# Altium schematic sheet ActiTouch_Receiver_Sheet1.SchDoc
size A4; SheetNumber: 4; SheetTotal: 5
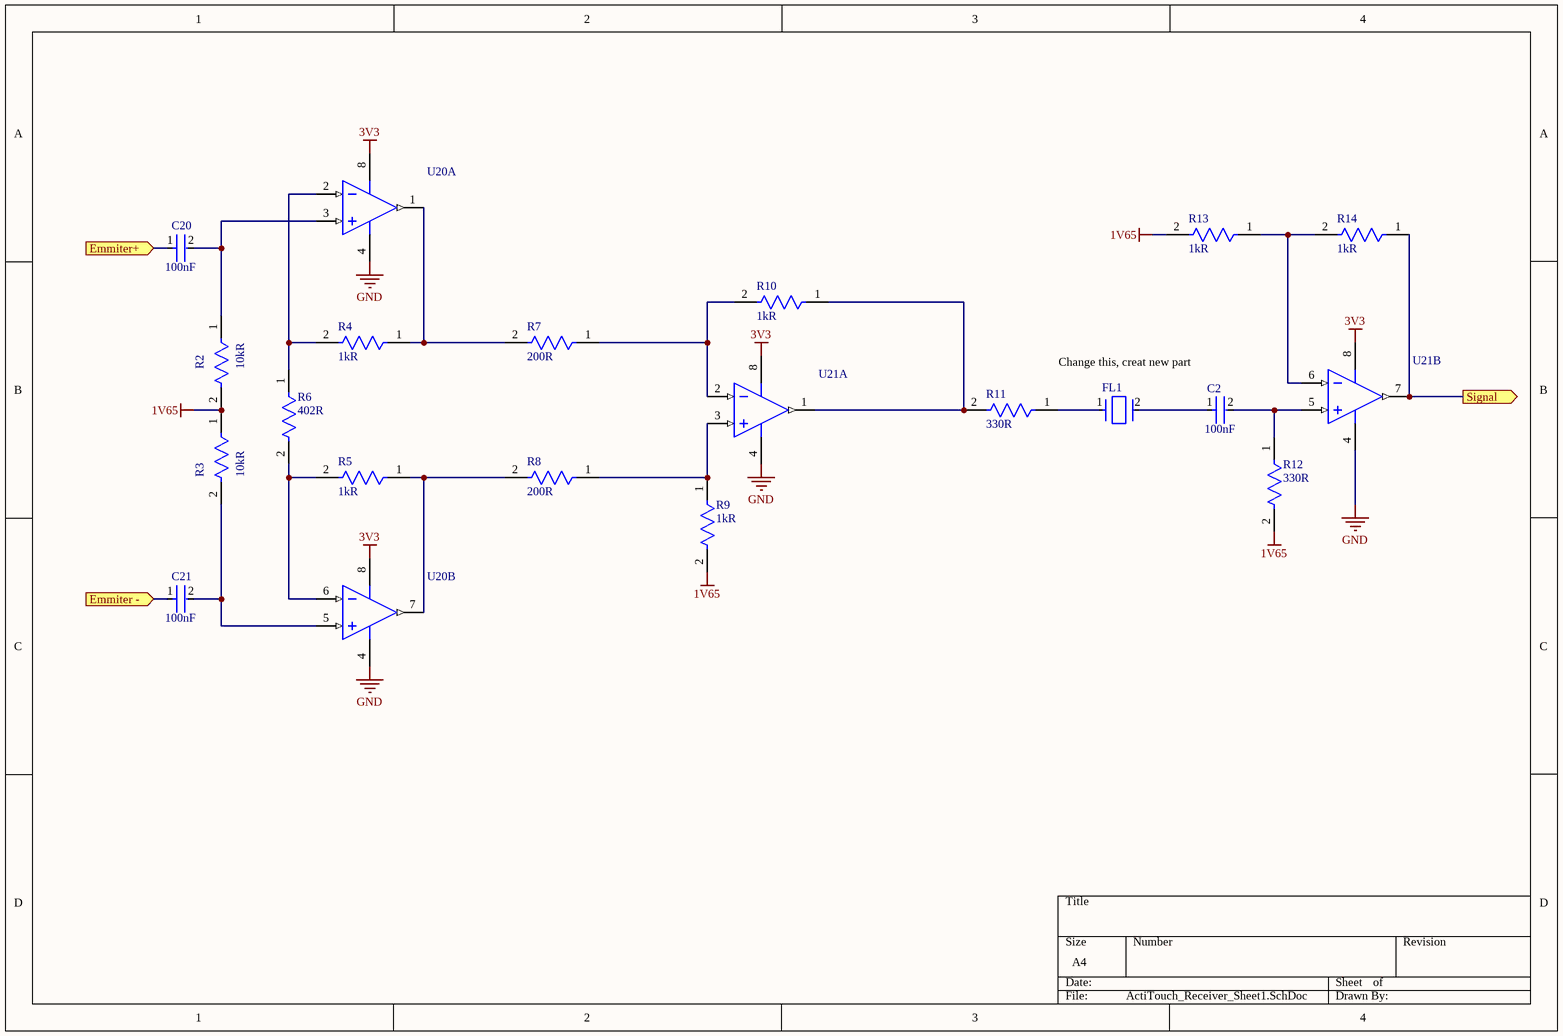
[diagram p0: ActiTouch_Receiver_Sheet1.SchDoc]

## Parts
C2  Capacitance: 100nF  [FP-0603-L_1_6_0_1-W_0_8_0-IPC_B]  (hidden comment: EMK107B7104KAHT)
C20  Capacitance: 100nF  [FP-0603-L_1_6_0_1-W_0_8_0-IPC_B]  (hidden comment: EMK107B7104KAHT)
C21  Capacitance: 100nF  [FP-0603-L_1_6_0_1-W_0_8_0-IPC_B]  (hidden comment: EMK107B7104KAHT)
FL1  CDSCB10M7GA121-R0  [FP-CDSCB10M7GA121-R0-MFG]  (value not drawn)
R2  Resistance: 10kR  [FP-ESR03-MFG]  (hidden comment: ESR03EZPJ101)
R3  Resistance: 10kR  [FP-ESR03-MFG]  (hidden comment: ESR03EZPJ101)
R4  Resistance: 1kR  [FP-ESR03-MFG]  (hidden comment: ESR03EZPJ101)
R5  Resistance: 1kR  [FP-ESR03-MFG]  (hidden comment: ESR03EZPJ101)
R6  Resistance: 402R  [FP-ESR03-MFG]  (hidden comment: ESR03EZPJ101)
R7  Resistance: 200R  [FP-ESR03-MFG]  (hidden comment: ESR03EZPJ101)
R8  Resistance: 200R  [FP-ESR03-MFG]  (hidden comment: ESR03EZPJ101)
R9  Resistance: 1kR  [FP-ESR03-MFG]  (hidden comment: ESR03EZPJ101)
R10  Resistance: 1kR  [FP-ESR03-MFG]  (hidden comment: ESR03EZPJ101)
R11  Resistance: 330R  [FP-ESR03-MFG]  (hidden comment: ESR03EZPJ101)
R12  Resistance: 330R  [FP-ESR03-MFG]  (hidden comment: ESR03EZPJ101)
R13  Resistance: 1kR  [FP-ESR03-MFG]  (hidden comment: ESR03EZPJ101)
R14  Resistance: 1kR  [FP-ESR03-MFG]  (hidden comment: ESR03EZPJ101)
U20  LTC6253IMS8#TRPBF  [LT-MS8-8_N]  (value not drawn)  (parts A,B of 2)
U21  LTC6253IMS8#TRPBF  [LT-MS8-8_N]  (value not drawn)  (parts A,B of 2)

## Ports
Emmiter - (in), Emmiter+ (in), Signal (out)

## Nets
1V65: R2.2 R3.1 R9.2 R12.2 R13.2
3V3: U20.8(V+) U21.8(V+)
GND: U20.4(V-) U21.4(V-)
Emmiter -: C21.1 ; port Emmiter -
Emmiter+: C20.1 ; port Emmiter+
Signal: R14.1 U21.7(OUT_B) ; port Signal
NetC2_1: C2.1 FL1.2
NetC2_2: C2.2 R12.1 U21.5(+IN_B)
NetC20_2: C20.2 R2.1 U20.3(+IN_A)
NetC21_2: C21.2 R3.2 U20.5(+IN_B)
NetFL1_1: FL1.1 R11.1
NetR4_1: R4.1 R7.2 U20.1(OUT_A)
NetR4_2: R4.2 R6.1 U20.2(-IN_A)
NetR5_1: R5.1 R8.2 U20.7(OUT_B)
NetR5_2: R5.2 R6.2 U20.6(-IN_B)
NetR7_1: R7.1 R10.2 U21.2(-IN_A)
NetR8_1: R8.1 R9.1 U21.3(+IN_A)
NetR10_1: R10.1 R11.2 U21.1(OUT_A)
NetR13_1: R13.1 R14.2 U21.6(-IN_B)

## Notes on the sheet
- Change this, creat new part

## Library data of the parts
C2 C20 C21 = CMP-14477-003798-2: None; Voltage Rating (DC): 16V; Tolerance: 10%; Package Quantity: 4000; Packaging: Tape and Reel; Lead Free: Lead Free; Voltage Rating: 16V; Halogen Free: Halogen Free; Case/Package: 0603
FL1 = CMP-06047-000004-1: Ceramic Filter 10.7MHz 2-Pin Surface Mount Emboss T/R
R2-R14 = CMP-08839-000028-1: 100Ω ±5% 0.25W 0603 Anti-Surge Chip Resistor AEC-Q200; Power Rating: 200mW; Temperature Coefficient: 200ppm/°C; Max Power Dissipation: 250mW; Case Code (Imperial): 0603; Number of Terminations: 2; RoHS Compliant: Yes; Series: ESR; Lead Free: Lead Free; Features: Automotive AEC-Q200; Case/Package: 0603; Tolerance: 5%; Min Operating Temperature: -55°C; Size Code: 0603; Case Code (Metric): 1608; Max Operating Temperature: 155°C; Packaging: Tape and Reel
U20 U21 = CMP-0359-00902-2: Dual Channel, Power Efficient Operational Amplifier, RRIO, 720 MHz Typical GBW, 280 V/us Typical SR, 2.5 to 5.25 V, 8-Pin SOP (MS8-8), Industrial, Pb-Free, Reel; Manufacturer: Linear Technology; GBW (MHz) Typical: 720; SR (V/us) Typical: 280; Vos (mV) Typical: 0.05; Vs Max (V): 5.25; Is (mA) Typical: 3.3; Channels (#): 2; Vs Min (V): 2.5; PackageVersion: Rev G; Packing: Reel; ComponentLink1Description: Manufacturer URL; ComponentLink3URL: http://cds.linear.com/docs/en/packaging/05081610_G_SO8.pdf; PackageDescription: 8-Lead Plastic Small Outline, Body 3.9 x 4.9 mm, Pitch 1.27 mm; Linear Technology Part Number: LTC6253; DatasheetVersion: Rev. C; ComponentLink3Description: Package Specification; ComponentLink1URL: http://www.linear.com/; Mounting Technology: Surface Mount; RoHS: Pb-Free; PartNumber: LTC6253IMS8#TRPBF; ComponentLink2URL: http://cds.linear.com/docs/en/datasheet/625234fc.pdf; PackageReference: LT-MS8-8; ComponentLink2Description: Datasheet; Type: VFB; RevisionNote: URLs updated